# Altium schematic sheet CLOCK.SchDoc: Clocks
size A3; DocumentNumber: 5; SheetNumber: 5; SheetTotal: 12
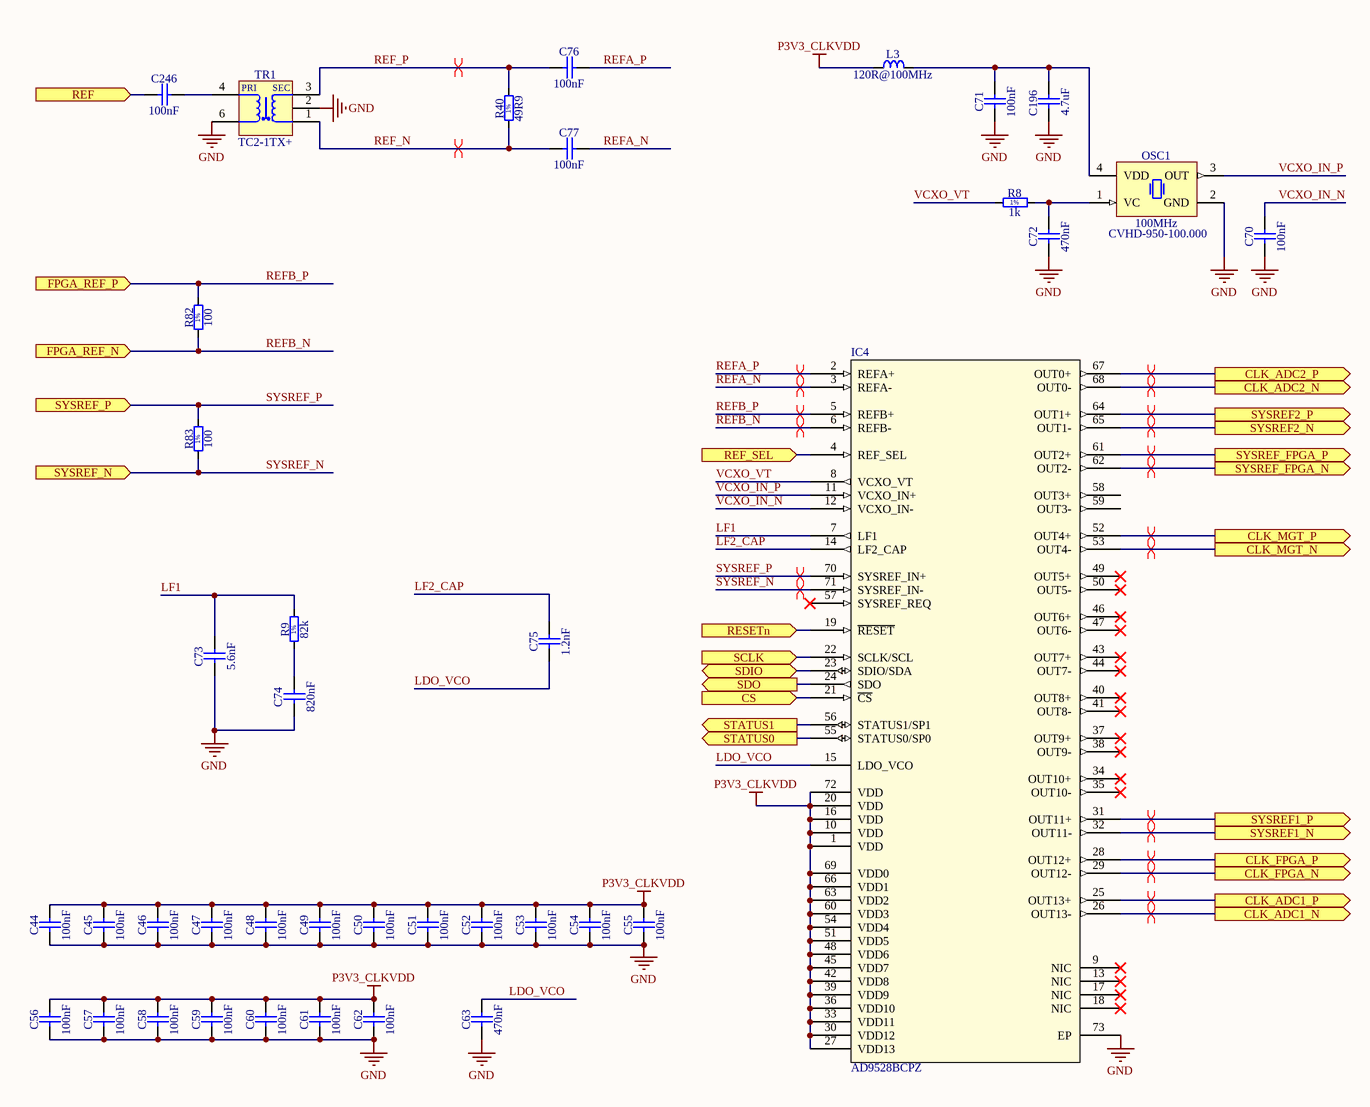
[diagram p0: CLOCK.SchDoc]

## Parts
C44  100nF  [CAPC0603X33N]
C45  100nF  [CAPC0603X33N]
C46  100nF  [CAPC0603X33N]
C47  100nF  [CAPC0603X33N]
C48  100nF  [CAPC0603X33N]
C49  100nF  [CAPC0603X33N]
C50  100nF  [CAPC0603X33N]
C51  100nF  [CAPC0603X33N]
C52  100nF  [CAPC0603X33N]
C53  100nF  [CAPC0603X33N]
C54  100nF  [CAPC0603X33N]
C55  100nF  [CAPC0603X33N]
C56  100nF  [CAPC0603X33N]
C57  100nF  [CAPC0603X33N]
C58  100nF  [CAPC0603X33N]
C59  100nF  [CAPC0603X33N]
C60  100nF  [CAPC0603X33N]
C61  100nF  [CAPC0603X33N]
C62  100nF  [CAPC0603X33N]
C63  470nF  [CAPC1005X55N]
C70  100nF  [CAPC0603X33N]
C71  100nF  [CAPC0603X33N]
C72  470nF  [CAPC1005X55N]
C73  5.6nF  [CAPC2012X88N]
C74  820nF  [CAPC3216X130N]
C75  1.2nF  [CAPC1608X80N]
C76  100nF  [CAPC1005X55N]
C77  100nF  [CAPC1005X55N]
C196  4.7uF  [CAPC1608X87N]
C246  100nF  [CAPC0603X33N]
IC4  AD9528BCPZ  [CP_72_6]
L3  120R@100MHz  [INDC1608X65N]
OSC1  100MHz  Manufacturer Part Number: CVHD-950-100.000  [OSC_CRYSTEK_CVHD-950]
R8  1k  [RESC1005X40N]
R9  82k  [RESC1005X40N]
R40  49R9  [RESC1005X40N]
R82  100  [RESC1005X40N]
R83  100  [RESC1005X40N]
TR1  TC2-1TX+  [XFMR_MINI-CIRCUITS_AT1521]

## Ports
CLK_ADC1_N (out), CLK_ADC1_P (out), CLK_ADC2_N (out), CLK_ADC2_P (out), CLK_FPGA_N (out), CLK_FPGA_P (out), CLK_MGT_N (out), CLK_MGT_P (out), CS (in), FPGA_REF_N (in), FPGA_REF_P (in), REF (in), REF_SEL (in), RESETn (in), SCLK (in), SDIO (bidir), SDO (out), STATUS0 (out), STATUS1 (out), SYSREF1_N (out), SYSREF1_P (out), SYSREF2_N (out), SYSREF2_P (out), SYSREF_FPGA_N (out), SYSREF_FPGA_P (out), SYSREF_N (in), SYSREF_P (in)

## Nets
GND: C44.1 C45.1 C46.1 C47.1 C48.1 C49.1 C50.1 C51.1 C52.1 C53.1 C54.1 C55.1 C56.1 C57.1 C58.1 C59.1 C60.1 C61.1 C62.1 C63.1 C70.1 C71.1 C72.1 C73.1 C74.1 C196.1 IC4.73(EP) OSC1.2(GND) TR1.2(NU) TR1.6(PDOT)
P3V3_CLKVDD: C44.2 C45.2 C46.2 C47.2 C48.2 C49.2 C50.2 C51.2 C52.2 C53.2 C54.2 C55.2 C56.2 C57.2 C58.2 C59.2 C60.2 C61.2 C62.2 IC4.1(VDD) IC4.10(VDD) IC4.16(VDD) IC4.20(VDD) IC4.27(VDD13) IC4.30(VDD12) IC4.33(VDD11) IC4.36(VDD10) IC4.39(VDD9) IC4.42(VDD8) IC4.45(VDD7) IC4.48(VDD6) IC4.51(VDD5) IC4.54(VDD4) IC4.60(VDD3) IC4.63(VDD2) IC4.66(VDD1) IC4.69(VDD0) IC4.72(VDD) L3.1
CLK_ADC1_N: IC4.26(OUT13-) ; port CLK_ADC1_N
CLK_ADC1_P: IC4.25(OUT13+) ; port CLK_ADC1_P
CLK_ADC2_N: IC4.68(OUT0-) ; port CLK_ADC2_N
CLK_ADC2_P: IC4.67(OUT0+) ; port CLK_ADC2_P
CLK_FPGA_N: IC4.29(OUT12-) ; port CLK_FPGA_N
CLK_FPGA_P: IC4.28(OUT12+) ; port CLK_FPGA_P
CLK_MGT_N: IC4.53(OUT4-) ; port CLK_MGT_N
CLK_MGT_P: IC4.52(OUT4+) ; port CLK_MGT_P
CS: IC4.21(~{CS}) ; port CS
LDO_VCO: C63.2 C75.1 IC4.15(LDO_VCO)
LF1: C73.2 IC4.7(LF1) R9.2
LF2_CAP: C75.2 IC4.14(LF2_CAP)
REF: C246.1 ; port REF
REF_N: C77.1 R40.1 TR1.1(SDOT)
REF_P: C76.1 R40.2 TR1.3(S)
REF_SEL: IC4.4(REF_SEL) ; port REF_SEL
REFA_N: C77.2 IC4.3(REFA-)
REFA_P: C76.2 IC4.2(REFA+)
REFB_N: IC4.6(REFB-) R82.1 ; port FPGA_REF_N
REFB_P: IC4.5(REFB+) R82.2 ; port FPGA_REF_P
RESETn: IC4.19(~{RESET}) ; port RESETn
SCLK: IC4.22(SCLK/SCL) ; port SCLK
SDIO: IC4.23(SDIO/SDA) ; port SDIO
SDO: IC4.24(SDO) ; port SDO
STATUS0: IC4.55(STATUS0/SP0) ; port STATUS0
STATUS1: IC4.56(STATUS1/SP1) ; port STATUS1
SYSREF1_N: IC4.32(OUT11-) ; port SYSREF1_N
SYSREF1_P: IC4.31(OUT11+) ; port SYSREF1_P
SYSREF2_N: IC4.65(OUT1-) ; port SYSREF2_N
SYSREF2_P: IC4.64(OUT1+) ; port SYSREF2_P
SYSREF_FPGA_N: IC4.62(OUT2-) ; port SYSREF_FPGA_N
SYSREF_FPGA_P: IC4.61(OUT2+) ; port SYSREF_FPGA_P
SYSREF_N: IC4.71(SYSREF_IN-) R83.1 ; port SYSREF_N
SYSREF_P: IC4.70(SYSREF_IN+) R83.2 ; port SYSREF_P
VCXO_IN_N: C70.2 IC4.12(VCXO_IN-)
VCXO_IN_P: IC4.11(VCXO_IN+) OSC1.3(OUT)
VCXO_VT: IC4.8(VCXO_VT) R8.1
NetC71_2: C71.2 C196.2 L3.2 OSC1.4(VDD)
NetC72_2: C72.2 OSC1.1(VC) R8.2
NetC74_2: C74.2 R9.1
NetC246_2: C246.2 TR1.4(P)

Not connected (* = marked no-connect by the designer): IC4 9(NIC)* 13(NIC)* 17(NIC)* 18(NIC)* 34(OUT10+)* 35(OUT10-)* 37(OUT9+)* 38(OUT9-)* 40(OUT8+)* 41(OUT8-)* 43(OUT7+)* 44(OUT7-)* 46(OUT6+)* 47(OUT6-)* 49(OUT5+)* 50(OUT5-)* 57(SYSREF_REQ)* 58(OUT3+) 59(OUT3-)

## Layout directives
differential pair: CLK_ADC1_N, CLK_ADC1_P, CLK_ADC2_N, CLK_ADC2_P, CLK_FPGA_N, CLK_FPGA_P, CLK_MGT_N, CLK_MGT_P, REF_N, REF_P, REFA_N, REFA_P, REFB_N, REFB_P, SYSREF1_N, SYSREF1_P, SYSREF2_N, SYSREF2_P, SYSREF_FPGA_N, SYSREF_FPGA_P, SYSREF_N, SYSREF_P

## Notes on the sheet
- Title
- Size:
- Date:
- A3
- Number:
- Revision:
- Sheet
- of
- Drawn by:
- File:
- (in symbol R0402_1K_1%_0.0625W_100PPM) 1%
- (in symbol R0402_49R9_1%_0.0625W_100PPM) 1%
- (in symbol R0402_82K_1%_0.0625W_100PPM) 1%
- (in symbol R0402_100R_1%_0.0625W_100PPM) 1%
- (in symbol XFMR_MINI-CIRCUITS_TC2-1TX+) PRI; SEC

## Library data of the parts
C44-C62 C70 C71 = CC0201_100NF_6.3V_10%_X5R: Non-polarised capacitor; Part Description: SMD Multilayer Chip Ceramic Capacitor; Manufacturer: GENERIC; Manufacturer1 Part Number: 02016D104KAT2A; Tolerance: ±10%; Voltage: 6.3V; TC: X5R; Value: 100nF; Part Number: CC0201_100NF_6.3V_10%_X5R; Component Kind: Standard; Component Type: Standard; Pin Count: 2; Status: Not Recommended; Manufacturer Part Number: CC0201_100NF_6.3V_10%_X5R; Case: 0201; Mounted: Yes; Socket: No; SMD: Yes; Sense: No; Manufacturer1 Example: AVX; Manufacturer1 ComponentHeight: 0.33mm; HelpURL: \\cern.ch\dfs\Applications\Altium\Datasheets\CC0201_X5R_AVX.pdf; Author: CERN DEM JLC; CreateDate: 03.12.2007; LatestRevisionDate: 03.12.2007
C63 C72 = CC0402_470NF_6.3V_10%_X5R: Non-polarised capacitor; Part Description: SMD Multilayer Chip Ceramic Capacitor; Manufacturer: GENERIC; Manufacturer1 Part Number: GRM155R60J474KE19D; Tolerance: ±10%; Voltage: 6.3V; TC: X5R; Value: 470nF; Part Number: CC0402_470NF_6.3V_10%_X5R; Component Kind: Standard; Component Type: Standard; Pin Count: 2; Status: Preferred; Manufacturer Part Number: CC0402_470NF_6.3V_10%_X5R; Case: 0402; Mounted: Yes; Socket: No; SMD: Yes; Sense: No; Manufacturer1 Example: MURATA; Manufacturer1 ComponentHeight: 0.55mm; HelpURL: \\cern.ch\dfs\Applications\Altium\Datasheets\CC0402_X5R_MURATA_GRM.pdf; Author: CERN DEM JLC; CreateDate: 22.04.2010; LatestRevisionDate: 22.04.2010
C73 = CC0805_5.6NF_50V_5%_C0G: Non-polarised capacitor; Part Description: SMD Multilayer Chip Ceramic Capacitor; Manufacturer: GENERIC; Manufacturer1 Part Number: GRM2195C1H562JA01D; Voltage: 50V; TC: C0G/NP0; Tolerance: ±5%; Part Number: CC0805_5.6NF_50V_5%_C0G; Component Kind: Standard; Component Type: Standard; Pin Count: 2; Value: 5.6nF; Status: Preferred; Manufacturer Part Number: CC0805_5.6NF_50V_5%_C0G; Case: 0805; Mounted: Yes; Socket: No; SMD: Yes; Sense: No; Manufacturer1 Example: Murata; Manufacturer1 ComponentHeight: 0.85mm; Author: *
C74 = CC1206_820NF_25V_10%_X7R: Non-polarised capacitor; Part Description: SMD Multilayer Chip Ceramic Capacitor; Manufacturer: GENERIC; Manufacturer1 Part Number: 12063C824KAT2A; Voltage: 25V; TC: X7R; Tolerance: ±10%; Part Number: CC1206_820NF_25V_10%_X7R; Component Kind: Standard; Component Type: Standard; Pin Count: 2; Value: 820nF; Manufacturer Part Number: CC1206_820NF_25V_10%_X7R; Case: 1206; Mounted: Yes; Socket: No; SMD: Yes; Sense: No; Manufacturer1 ComponentHeight: 1.25mm; Manufacturer1 Example: AVX
C75 = CC0603_1.2NF_50V_5%_C0G: Non-polarised capacitor; Part Description: SMD Multilayer Chip Ceramic Capacitor; Manufacturer: GENERIC; Manufacturer1 Part Number: C0603C122J5GACTU; Tolerance: ±5%; Voltage: 50V; TC: C0G/NP0; Value: 1.2nF; Part Number: CC0603_1.2NF_50V_5%_C0G; Component Kind: Standard; Component Type: Standard; Pin Count: 2; Status: Preferred; Manufacturer Part Number: CC0603_1.2NF_50V_5%_C0G; Case: 0603; Mounted: Yes; Socket: No; SMD: Yes; Sense: No; Manufacturer1 Example: KEMET; Manufacturer1 ComponentHeight: 0.8mm; Author: *
C76 C77 = CC0402_100NF_16V_10%_X5R: Non-polarised capacitor; Part Description: SMD Multilayer Chip Ceramic Capacitor; Manufacturer: GENERIC; Manufacturer1 Part Number: GRM155R61C104KA88D; Tolerance: ±10%; Voltage: 16V; TC: X5R; Value: 100nF; Part Number: CC0402_100NF_16V_10%_X5R; Component Kind: Standard; Component Type: Standard; Pin Count: 2; Status: None; Manufacturer Part Number: CC0402_100NF_16V_10%_X5R; Case: 0402; Mounted: Yes; Socket: No; SMD: Yes; Sense: No; Manufacturer1 Example: MURATA; Manufacturer1 ComponentHeight: 0.55mm; HelpURL: \\cern.ch\dfs\Applications\Altium\Datasheets\CC0402_X5R_MURATA_GRM.pdf; Author: CERN DEM JLC; CreateDate: 10.12.2013; LatestRevisionDate: 10.12.2013
C196 = CC0603_4.7UF_6.3V_10%_X5R: Non-polarised capacitor; Part Description: SMD Multilayer Chip Ceramic Capacitor; Manufacturer: GENERIC; Manufacturer1 Part Number: 225520613672; Voltage: 6.3V; TC: X5R; Tolerance: ±10%; Part Number: CC0603_4.7UF_6.3V_10%_X5R; Component Kind: Standard; Component Type: Standard; Pin Count: 2; Value: 4.7uF; Status: Preferred; Manufacturer Part Number: CC0603_4.7uF_6.3V_10%_X5R; Case: 0603; Mounted: Yes; Socket: No; SMD: Yes; Manufacturer1 Example: PHYCOMP; Manufacturer1 ComponentHeight: 0.87mm; HelpURL: \\cern.ch\dfs\Applications\Altium\Datasheets\CC0805_X5R_PHYCOMP_HC.pdf; Author: CERN DEM JLC; CreateDate: 03.12.2007; LatestRevisionDate: 03.12.2007; Sense: No
C246 = CC0201_100NF_6.3V_10%_X5R: Non-polarised capacitor; Part Description: SMD Multilayer Chip Ceramic Capacitor; Manufacturer: GENERIC; Manufacturer1 Part Number: 02016D104KAT2A; Voltage: 6.3V; TC: X5R; Tolerance: ±10%; Part Number: CC0201_100NF_6.3V_10%_X5R; Component Kind: Standard; Component Type: Standard; Pin Count: 2; Value: 100nF; Status: Not Recommended; Manufacturer Part Number: CC0201_100NF_6.3V_10%_X5R; Case: 0201; Mounted: Yes; Socket: No; SMD: Yes; Sense: No; Manufacturer1 Example: AVX; Manufacturer1 ComponentHeight: 0.33mm; HelpURL: \\cern.ch\dfs\Applications\Altium\Datasheets\CC0201_X5R_AVX.pdf; Author: CERN DEM JLC; CreateDate: 03.12.2007; LatestRevisionDate: 03.12.2007
IC4 = AD9528BCPZ: JESD204B Clock Generator with 14 LVDS/HSTL Outputs; Manufacturer: Analog Devices; Manufacturer Part Number: AD9528BCPZ
L3 = IND0603_MURATA_BLM18SG121TN1D: Inductor; Part Description: SMD EMIFIL Suppression Chip Ferrite Bead; Manufacturer: MURATA; Power: 3A; Resistance: 0.025R; Tolerance: ±25%; Part Number: IND0603_MURATA_BLM18SG121TN1D; Component Kind: Standard; Component Type: Standard; Pin Count: 2; Value: 120R@100MHz; Status: None; Manufacturer Part Number: BLM18SG121TN1D; Case: 0603; Mounted: Yes; Socket: No; SMD: Yes; Sense: No; ComponentHeight: 0.65mm; HelpURL: \\cern.ch\dfs\Applications\Altium\Datasheets\IND0603_MURATA_BLM18S.pdf; Author: CERN DEM JLC; CreateDate: 23.07.2014; LatestRevisionDate: 23.07.2014
OSC1 = OSC_125MHZ_CRYSTEK_CVHD-950-100.000: Oscillator 4 pins 1=VC 2=GND 3=OUT 4=VDD; Part Description: 3.3V, ±20ppm, 15pF, 0..70°C, CMOS Surface Mount Ultra-Low Noise Oscillator (CVHD-950 Series); Manufacturer: CRYSTEK CRYSTAL; PressFit: No; Bonding: No; Part Number: OSC_125MHZ_CRYSTEK_CVHD-950-100.000; Component Kind: Standard; Component Type: Standard; PackageDescription: Oscillator, 5.08mm Pitch; 4 Pin, 14.2mm L X 9.14mm W X 5.3mm H, CVHD-950 Serie; Value: 100MHz; Pin Count: 4; Mounted: Yes; Socket: No; SMD: Yes; ComponentHeight: 5.3mm; HelpURL: \\cern.ch\dfs\Applications\Altium\Datasheets\OSC_CRYSTEK_CVHD-950.pdf; Author: CERN DEM JLC; CreateDate: 09.10.2012; LatestRevisionDate: 09.10.2012; Sense: No
R8 = R0402_1K_1%_0.0625W_100PPM: Resistor - 1%; Part Description: General Purpose Thick Film Chip Resistor; Manufacturer: GENERIC; Manufacturer1 Part Number: 232270671002L; TC: ±100ppm/°C; Tolerance: ±1%; Value: 1k; Power: 0.0625W; Part Number: R0402_1K_1%_0.0625W_100PPM; Component Kind: Standard; Component Type: Standard; Pin Count: 2; Status: Not recommended; Manufacturer Part Number: R0402_1K_1%_0.0625W_100PPM; Case: 0402; Mounted: Yes; Sense: No; Socket: No; SMD: Yes; Manufacturer1 Example: YAGEO PHYCOMP; Manufacturer1 ComponentHeight: 0.4mm; HelpURL: \\cern.ch\dfs\Applications\Altium\Datasheets\R0402_Phycomp_RC0402.pdf; Author: CERN DEM JLC; CreateDate: 03.12.2007; LatestRevisionDate: 17.10.2012
R9 = R0402_82K_1%_0.0625W_100PPM: Resistor - 1%; Part Description: General Purpose Thick Film Chip Resistor; Manufacturer: GENERIC; Manufacturer1 Part Number: 232270678203L; TC: ±100ppm/°C; Value: 82k; Tolerance: ±1%; Power: 0.0625W; Part Number: R0402_82K_1%_0.0625W_100PPM; Component Kind: Standard; Component Type: Standard; Pin Count: 2; Status: Not recommended; Manufacturer Part Number: R0402_82K_1%_0.0625W_100PPM; Case: 0402; Mounted: Yes; Sense: No; Socket: No; SMD: Yes; Manufacturer1 Example: YAGEO PHYCOMP; Manufacturer1 ComponentHeight: 0.4mm; HelpURL: \\cern.ch\dfs\Applications\Altium\Datasheets\R0402_Phycomp_RC0402.pdf; Author: CERN DEM JLC; CreateDate: 03.12.2007; LatestRevisionDate: 17.10.2012
R40 = R0402_49R9_1%_0.0625W_100PPM: Resistor - 1%; Part Description: General Purpose Thick Film Chip Resistor; Manufacturer: GENERIC; Manufacturer1 Part Number: 232270674999L or RC0402FR-0749R9L; TC: ±100ppm/°C; Part Number: R0402_49R9_1%_0.0625W_100PPM; Component Kind: Standard; Component Type: Standard; Pin Count: 2; Value: 49R9; Status: Not recommended; Power: 0.0625W; Tolerance: ±1%; Manufacturer Part Number: R0402_49R9_1%_0.0625W_100PPM; Case: 0402; Mounted: Yes; Sense: No; Socket: No; SMD: Yes; Manufacturer1 Example: YAGEO PHYCOMP; Manufacturer1 ComponentHeight: 0.4mm; HelpURL: \\cern.ch\dfs\Applications\Altium\Datasheets\R0402_Phycomp_RC0402.pdf; Author: CERN DEM JLC; CreateDate: 24.10.2012; LatestRevisionDate: 24.10.2012
R82 R83 = R0402_100R_1%_0.0625W_100PPM: Resistor - 1%; Part Description: General Purpose Thick Film Chip Resistor; Manufacturer: GENERIC; Manufacturer1 Part Number: 232270671001L; TC: ±100ppm/°C; Part Number: R0402_100R_1%_0.0625W_100PPM; Component Kind: Standard; Component Type: Standard; Pin Count: 2; Value: 100; Status: Not recommended; Power: 0.0625W; Tolerance: ±1%; Manufacturer Part Number: R0402_100R_1%_0.0625W_100PPM; Case: 0402; Mounted: Yes; Socket: No; SMD: Yes; Manufacturer1 Example: YAGEO PHYCOMP; Manufacturer1 ComponentHeight: 0.4mm; HelpURL: \\cern.ch\dfs\Applications\Altium\Datasheets\R0402_Phycomp_RC0402.pdf; Author: CERN DEM JLC; CreateDate: 03.12.2007; LatestRevisionDate: 17.10.2012; Sense: No
TR1 = XFMR_MINI-CIRCUITS_TC2-1TX+: 50 Ohm 3 to 300MHz RF Transformer; Manufacturer: MINI-CIRCUITS; Manufacturer Part Number: TC2-1TX+; HelpURL: https://ww2.minicircuits.com/pdfs/TC2-1TX+.pdf